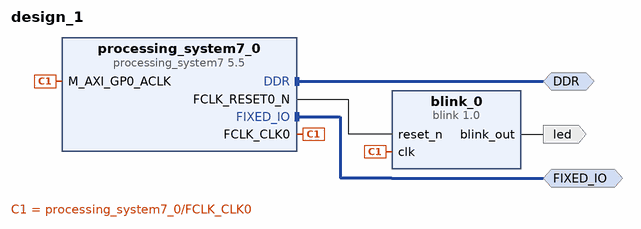
[diagram p0: block diagram of the top level]
# Vivado block design design_1, xc7z010clg400-1, Vivado 2017.2
create_bd_design design_1

create_bd_intf_port -mode Master -vlnv xilinx.com:interface:ddrx_rtl:1.0 DDR
create_bd_intf_port -mode Master -vlnv xilinx.com:display_processing_system7:fixedio_rtl:1.0 FIXED_IO
create_bd_port -dir O led

create_bd_cell -type ip -vlnv xilinx.com:ip:processing_system7:5.5 processing_system7_0
set_property -dict [list \
  CONFIG.PCW_UIPARAM_DDR_FREQ_MHZ 400 \
  CONFIG.PCW_APU_PERIPHERAL_FREQMHZ 667 \
  CONFIG.PCW_QSPI_PERIPHERAL_FREQMHZ 200.000000 \
  CONFIG.PCW_SDIO_PERIPHERAL_FREQMHZ 100 \
  CONFIG.PCW_UART_PERIPHERAL_FREQMHZ 50 \
  CONFIG.PCW_FPGA0_PERIPHERAL_FREQMHZ 50 \
  CONFIG.PCW_FPGA1_PERIPHERAL_FREQMHZ 10 \
  CONFIG.PCW_FPGA2_PERIPHERAL_FREQMHZ 10 \
  CONFIG.PCW_FPGA3_PERIPHERAL_FREQMHZ 10 \
  CONFIG.PCW_PRESET_BANK0_VOLTAGE {LVCMOS 1.8V} \
  CONFIG.PCW_PRESET_BANK1_VOLTAGE {LVCMOS 1.8V} \
  CONFIG.PCW_UIPARAM_DDR_MEMORY_TYPE {LPDDR 2} \
  CONFIG.PCW_UIPARAM_DDR_PARTNO Custom \
  CONFIG.PCW_QSPI_PERIPHERAL_ENABLE 1 \
  CONFIG.PCW_QSPI_GRP_SINGLE_SS_ENABLE 1 \
  CONFIG.PCW_QSPI_GRP_SINGLE_SS_IO {MIO 1 .. 6} \
  CONFIG.PCW_QSPI_GRP_FBCLK_ENABLE 1 \
  CONFIG.PCW_SD0_PERIPHERAL_ENABLE 1 \
  CONFIG.PCW_SD0_SD0_IO {MIO 40 .. 45} \
  CONFIG.PCW_SD1_PERIPHERAL_ENABLE 1 \
  CONFIG.PCW_SD1_SD1_IO {MIO 10 .. 15} \
  CONFIG.PCW_UART0_PERIPHERAL_ENABLE 1 \
  CONFIG.PCW_UART0_UART0_IO {MIO 50 .. 51} \
  CONFIG.PCW_SPI1_PERIPHERAL_ENABLE 1 \
  CONFIG.PCW_SPI1_SPI1_IO {MIO 46 .. 51} \
  CONFIG.PCW_USB_RESET_ENABLE 1 \
  CONFIG.PCW_I2C_RESET_ENABLE 1 \
  CONFIG.PCW_GPIO_PERIPHERAL_ENABLE 1 \
  CONFIG.PCW_GPIO_MIO_GPIO_ENABLE 1 \
  CONFIG.PCW_GPIO_MIO_GPIO_IO MIO \
  CONFIG.PCW_GPIO_EMIO_GPIO_ENABLE 1 \
  CONFIG.PCW_GPIO_EMIO_GPIO_IO 64 \
] [get_bd_cells processing_system7_0]
# 156 more settings of processing_system7_0 are not shown: defaults, MIO pin electricals, DDR timing, and values the tool derives
create_bd_cell -type ip -vlnv craftdrones:user:blink:1.0 blink_0
set_property -dict {CONFIG.max_count 50000000} [get_bd_cells blink_0]

# ---- connections ----

connect_bd_intf_net [get_bd_intf_ports DDR] [get_bd_intf_pins processing_system7_0/DDR]
connect_bd_intf_net [get_bd_intf_ports FIXED_IO] [get_bd_intf_pins processing_system7_0/FIXED_IO]
connect_bd_net [get_bd_pins processing_system7_0/FCLK_CLK0] [get_bd_pins processing_system7_0/M_AXI_GP0_ACLK] [get_bd_pins blink_0/clk]
connect_bd_net [get_bd_pins processing_system7_0/FCLK_RESET0_N] [get_bd_pins blink_0/reset_n]
connect_bd_net [get_bd_pins blink_0/blink_out] [get_bd_ports led]

validate_bd_design
save_bd_design
